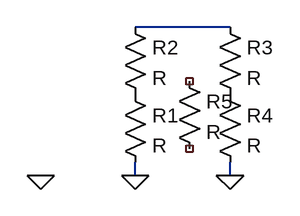
[diagram p0: schematic Draft1.asc]
Draft1.asc, the LTspice schematic file:
Version 4
SHEET 1 880 680
WIRE 304 32 192 32
WIRE 192 208 192 192
WIRE 304 208 304 192
FLAG 80 208 0
FLAG 192 208 0
FLAG 304 208 0
SYMBOL res 176 96 R0
SYMATTR InstName R1
SYMBOL res 176 16 R0
SYMATTR InstName R2
SYMBOL res 288 16 R0
SYMATTR InstName R3
SYMBOL res 288 96 R0
SYMATTR InstName R4
SYMBOL res 240 80 R0
SYMATTR InstName R5

The netlist it stands for:
* Draft1.asc
R1 P001 0 R
R2 N001 P001 R
R3 N001 P002 R
R4 P002 0 R
R5 NC_01 NC_02 R
.backanno
.end